# Altium project Quadrotor.PrjPCB (part 2 of 2)

## Sheet Battery Pack & Charger.SchDoc
size A4
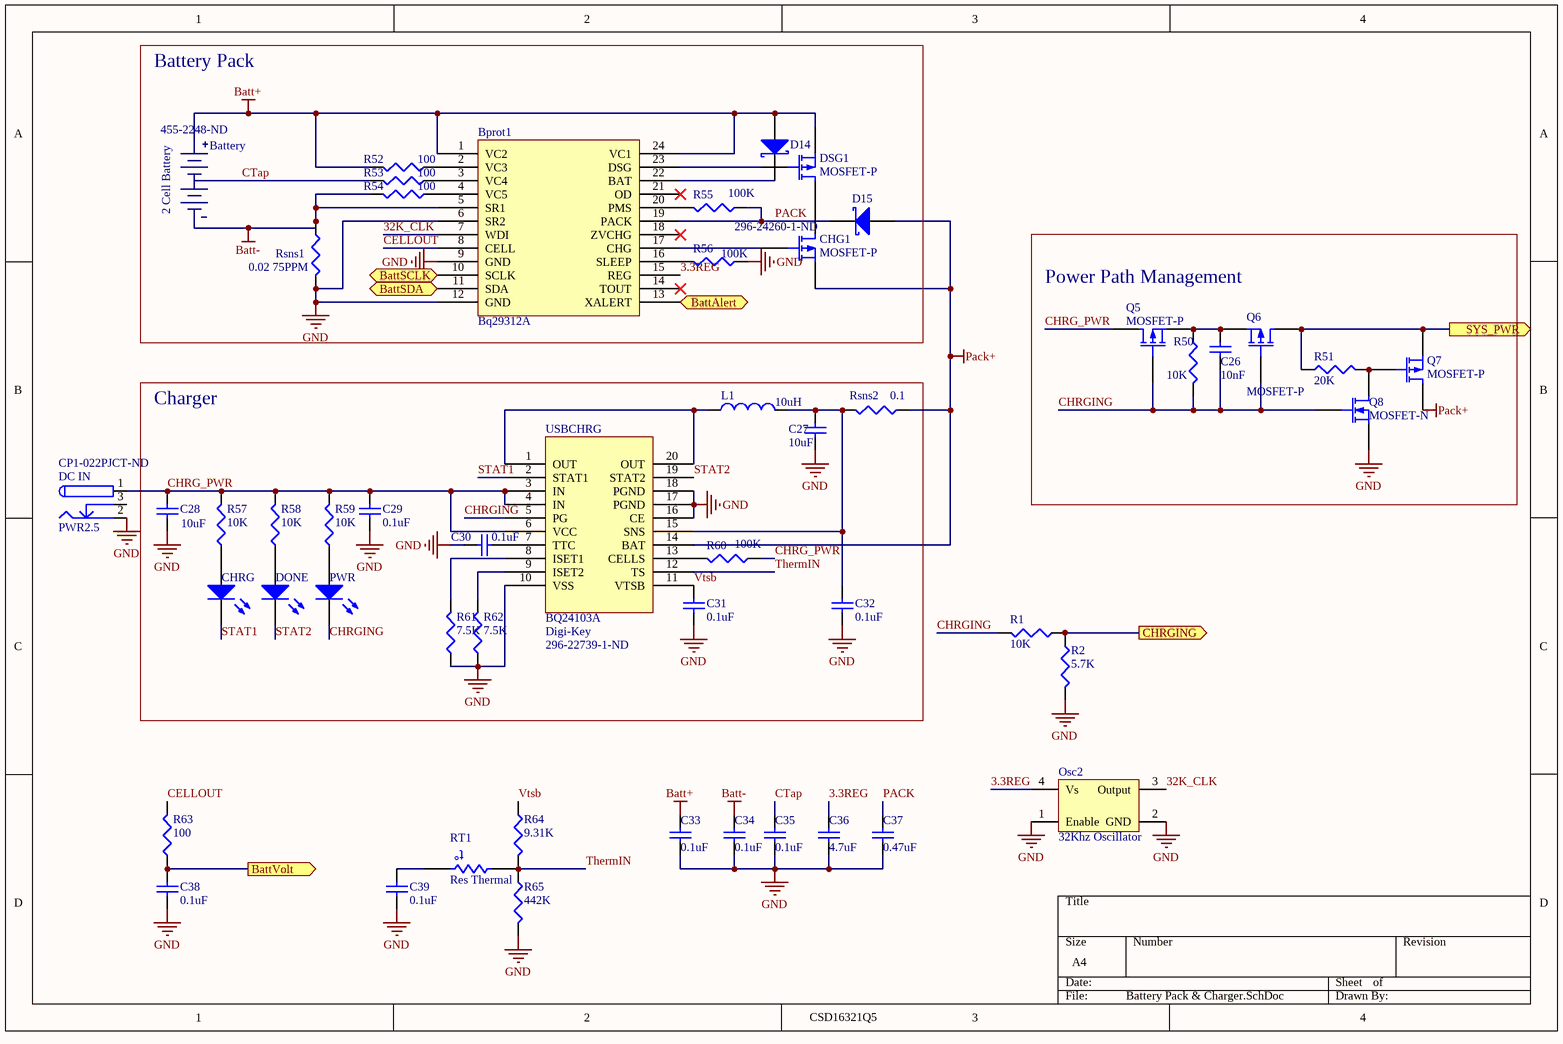
[diagram p7: Battery Pack & Charger.SchDoc]

### Parts
Battery  2 Cell Battery  Supplier Part Number 1: 455-2248-ND  [Turnigy Nanotech 2cell]
Bprot1  Bq29312A  [TSOP65P640X120-24N]
C26  value 10nF  [0603_CAP]  (hidden comment: X7R Cap)
C27  value 10uF  [0603_CAP]  (hidden comment: X7R Cap)
C28  value 10uF  [0603_CAP]  (hidden comment: X7R Cap)
C29  value 0.1uF  [0603_CAP]  (hidden comment: X7R Cap)
C30  value 0.1uF  [0603_CAP]  (hidden comment: X7R Cap)
C31  value 0.1uF  [0603_CAP]  (hidden comment: X7R Cap)
C32  value 0.1uF  [0603_CAP]  (hidden comment: X7R Cap)
C33  value 0.1uF  [0603_CAP]  (hidden comment: X7R Cap)
C34  value 0.1uF  [0603_CAP]  (hidden comment: X7R Cap)
C35  value 0.1uF  [0603_CAP]  (hidden comment: X7R Cap)
C36  value 4.7uF  [0603_CAP]  (hidden comment: X7R Cap)
C37  value 0.47uF  [0603_CAP]  (hidden comment: X7R Cap)
C38  value 0.1uF  [0603_CAP]  (hidden comment: X7R Cap)
C39  value 0.1uF  [0603_CAP]  (hidden comment: X7R Cap)
CHG1  MOSFET-P  [CSD16321Q5_PFET]
CHRG  LED0  [0603_RES]  (value not drawn)
D14  Diode 10TQ035  [DIODE]  (value not drawn)
D15  Diode 10TQ035  [DIODE]  (value not drawn)
DC_IN  PWR2.5  Supplier Part Number 1: CP1-022PJCT-ND  [DC Power JAck]
DONE  LED0  [0603_RES]  (value not drawn)
DSG1  MOSFET-P  [CSD16321Q5_PFET]
L1  value 10uH  [INDM7575X45N]  (hidden comment: Inductor)
Osc2  32Khz Oscillator  [Oscillator]
PWR  LED0  [0603_RES]  (value not drawn)
Q5  MOSFET-P  [CSD16321Q5_PFET]
Q6  MOSFET-P  [CSD16321Q5_PFET]
Q7  MOSFET-P  [CSD16321Q5_PFET]
Q8  MOSFET-N  [CSD16321Q5]
R1  value 10K  [0603_RES]  (hidden comment: Res3)
R2  value 5.7K  [0603_RES]  (hidden comment: Res3)
R50  value 10K  [0603_RES]  (hidden comment: Res3)
R51  value 20K  [0603_RES]  (hidden comment: Res3)
R52  value 100  [0603_RES]
R53  value 100  [0603_RES]
R54  value 100  [0603_RES]
R55  value 100K  [RESC1608L]
R56  value 100K  [RESC1608L]
R57  value 10K  [0603_RES]  (hidden comment: Res3)
R58  value 10K  [0603_RES]  (hidden comment: Res3)
R59  value 10K  [0603_RES]  (hidden comment: Res3)
R60  value 100K  [RESC1608L]
R61  value 7.5K  [0603_RES]
R62  value 7.5K  [0603_RES]
R63  value 100  [0603_RES]
R64  value 9.31K  [0603_RES]  (hidden comment: Rpull)
R65  value 442K  [0603_RES]  (hidden comment: Rpull)
Rsns1  value 0.02 75PPM  [CRA2512]
Rsns2  value 0.1  [CRA2512]  (hidden comment: Rpull)
RT1  Res Thermal  [RESC2012N]
USBCHRG  BQ24103A  Supplier 1: Digi-Key  [QFN50P350X450X100-20N]

### Blocks framed on the sheet
Battery Pack: Battery Bprot1 CHG1 D14 D15 DSG1 R52-R56 Rsns1
Power Path Management: C26 Q5-Q8 R50 R51
Charger: C27-C32 CHRG DONE L1 PWR R57-R62 Rsns2 USBCHRG

### Ports
BattAlert (out), BattSCLK (in), BattSDA (in), BattVolt (out), CHRGING (out), SYS_PWR (out)

### Nets
Batt+: Battery.1(+) Bprot1.1(VC2) Bprot1.24(VC1) C33.1 D14.1(A) DSG1.3(S) R52.2
Batt-: Battery.3(-) Bprot1.5(SR1) C34.1 R54.2 Rsns1.1
GND: Bprot1.6(SR2) Bprot1.9(GND) Bprot1.12(GND) C27.1 C28.1 C29.2 C30.1 C31.2 C32.2 C33.2 C34.2 C35.2 C36.2 C37.2 C38.1 C39.1 DC_IN.2 Osc2.1(Enable) Osc2.2(GND) Q8.3(S) R2.2 R56.1 R61.1 R62.1 R65.2 Rsns1.2 USBCHRG.10(VSS) USBCHRG.16(CE) USBCHRG.17(PGND) USBCHRG.18(PGND)
Pack+: CHG1.3(S) D15.2(A) Q7.1(D) Rsns2.1 USBCHRG.14(BAT)
PWR_IN: Q6.1(D) Q7.3(S) R51.1 ; port SYS_PWR
3.3REG: Bprot1.15(REG) C36.1 Osc2.4(Vs)
32K_CLK: Bprot1.7(WDI) Osc2.3(Output)
CELLOUT: Bprot1.8(CELL) R63.2
CHRG_PWR: C28.2 C29.1 DC_IN.1 Q5.1(D) R57.2 R58.2 R59.2 R60.1 USBCHRG.3(IN) USBCHRG.4(IN) USBCHRG.6(VCC)
CHRGING: C26.1 PWR.2(K) Q5.2(G) Q6.2(G) Q8.2(G) R1.2 R50.2 USBCHRG.5(PG)
CTap: Battery.2(Ctap) C35.1 R53.2
PACK: Bprot1.19(PACK) C37.1 D15.1(K) R55.1
STAT1: CHRG.2(K) USBCHRG.2(STAT1)
STAT2: DONE.2(K) USBCHRG.19(STAT2)
ThermIN: R64.2 R65.1 RT1.2 USBCHRG.12(TS)
Vtsb: C31.1 R64.1 USBCHRG.11(VTSB)
NetBprot1_2: Bprot1.2(VC3) R52.1
NetBprot1_3: Bprot1.3(VC4) R53.1
NetBprot1_4: Bprot1.4(VC5) R54.1
NetBprot1_10: Bprot1.10(SCLK) ; port BattSCLK
NetBprot1_11: Bprot1.11(SDA) ; port BattSDA
NetBprot1_13: Bprot1.13(XALERT) ; port BattAlert
NetBprot1_16: Bprot1.16(SLEEP) R56.2
NetBprot1_17: Bprot1.17(CHG) CHG1.2(G)
NetBprot1_20: Bprot1.20(PMS) R55.2
NetBprot1_22: Bprot1.22(BAT) D14.2(K)
NetBprot1_23: Bprot1.23(DSG) DSG1.2(G)
NetC26_2: C26.2 Q5.3(S) Q6.3(S) R50.1
NetC27_2: C27.2 C32.1 L1.2 Rsns2.2 USBCHRG.15(SNS)
NetC30_2: C30.2 USBCHRG.7(TTC)
NetC38_2: C38.2 R63.1 ; port BattVolt
NetC39_2: C39.2 RT1.1
NetCHG1_1: CHG1.1(D) DSG1.1(D)
NetCHRG_1: CHRG.1(A) R57.1
NetDONE_1: DONE.1(A) R58.1
NetL1_1: L1.1 USBCHRG.1(OUT) USBCHRG.20(OUT)
NetPWR_1: PWR.1(A) R59.1
NetQ7_2: Q7.2(G) Q8.1(D) R51.2
NetR1_1: R1.1 R2.1 ; port CHRGING
NetR60_2: R60.2 USBCHRG.13(CELLS)
NetR61_2: R61.2 USBCHRG.8(ISET1)
NetR62_2: R62.2 USBCHRG.9(ISET2)

Not connected (* = marked no-connect by the designer): Bprot1 14(TOUT)* 18(ZVCHG)* 21(OD)*; DC_IN 3

### Notes on the sheet
- CSD16321Q5
- (in symbol Res Thermal) t°

### Library data of the parts
Battery = 2 Cell Battery: Manufacturer: JST Sales America Inc; Manufacturer Part Number: B3B-XH-A  (LF)(SN)(P);; Description: CONN HEADER XH TOP 3POS 2.5MM; Connector Type: Header, Shrouded; Number of Positions: 3; Number of Positions Loaded: All; Pitch: 0.098" (2.50mm); Supplier 1: Digi-Key; RoHS: RoHS Compliant; Category: Connectors, Interconnects; Stock 1: 38279; Pricing 1: 1=0.12, 10=0.11, 100=0.0915, 500=0.07324, 1000=0.06079, 5000=0.05493, 10000=0.04871 (USD); Contact Type: Male Pin; Number of Rows: 1; Row Spacing: -; Contact Mating Length: -; Mounting Type: Through Hole; Termination: Press-Fit; Fastening Type: -; Features: -; Contact Finish: Tin; Contact Finish Thickness: -; Color: Natural; Packaging: Bulk; ComponentLink1URL: http://www.jst-mfg.com/product/pdf/eng/eXH.pdf; ComponentLink1Description: http://www.jst-mfg.com/product/pdf/eng/eXH.pdf
Bprot1 = Bq29312A: 296-19870-1-ND; Supplier 1: Digi-Key; Supplier Part Number 1: 296-19870-1-ND
C26-C39 = Cap: Capacitor; Published: 8-Jun-2000; LatestRevisionDate: 17-Jul-2002; LatestRevisionNote: Re-released for DXP Platform.; PackageReference: RAD-0.3; Publisher: Altium Limited
CHG1 DSG1 Q5-Q7 = MOSFET-P: 296-24260-1-ND; Manufacturer: Texas Instruments; Manufacturer Part Number: CSD25401Q3; Description: MOSFET P-CH 20V 60A 8-SON; FET Type: MOSFET P-Channel, Metal Oxide; FET Feature: Logic Level Gate; Rds On (Max) @ Id, Vgs: 11.7 mOhm @ 10A, 4.5V; Drain to Source Voltage (Vdss): 20V; Current - Continuous Drain (Id) @ 25° C: 60A; Vgs(th) (Max) @ Id: 1.2V @ 250µA; Gate Charge (Qg) @ Vgs: 12.3nC @ 4.5V; Input Capacitance (Ciss) @ Vds: 1400pF @ 10V; Power - Max: 2.8W; Published: 8-Jun-2000; LatestRevisionDate: 17-Jul-2002; LatestRevisionNote: Re-released for DXP Platform.; PackageVersion: 1995/1996; PackageReference: E3; Publisher: Altium Limited; Supplier 1: Digi-Key; Supplier Part Number 1: 296-24260-1-ND; RoHS: RoHS Compliant By Exemption; Category: Discrete Semiconductor Products; Stock 1: 15742; Pricing 1: 1=1.55, 25=1.2212, 100=1.0989, 250=0.95644, 500=0.8547, 1000=0.67155 (USD); Mounting Type: Surface Mount; Package / Case: 8-TDFN Exposed Pad; Supplier Device Package: 8-SON; Packaging: Cut Tape (CT); ComponentLink1URL: http://www.ti.com/lit/ds/symlink/csd25401q3.pdf; ComponentLink1Description: http://www.ti.com/lit/ds/symlink/csd25401q3.pdf
CHRG DONE PWR = LED0: Typical INFRARED GaAs LED; Published: 8-Jun-2000; LatestRevisionDate: 08-Jul-2005; LatestRevisionNote: Mech Layer 1 removed.; PackageReference: LED-0; Publisher: Altium Limited
D14 D15 = Diode 10TQ035: Schottky Rectifier; Manufacturer: ON Semiconductor; Manufacturer Part Number: MBRS320T3G; Note: Terminal 2 is the TAB and is electrically connected to the cathode; Description: DIODE SCHOTTKY 20V 4A SMC; Voltage - DC Reverse (Vr) (Max): 20V; Current - Average Rectified (Io): 4A; Voltage - Forward (Vf) (Max) @ If: 500mV @ 3A; Speed: Fast Recovery =< 500ns, > 200mA (Io); Current - Reverse Leakage @ Vr: 2mA @ 20V; Published: 8-Jun-2000; LatestRevisionDate: 17-Jul-2002; LatestRevisionNote: Re-released for DXP Platform.; DatasheetVersion: PD-2.057B; PackageVersion: Feb-1998; PackageReference: TO-220AC; Publisher: Altium Limited; ComponentLink1Description: Manufacturer Link; ComponentLink1URL: http://www.irf.com/; ComponentLink2Description: Datasheet; ComponentLink2URL: http://www.irf.com/product-info/datasheets/data/10tq.pdf; Supplier 1: Digi-Key; Supplier Part Number 1: MBRS320T3GOSCT-ND; RoHS: RoHS Compliant; Category: Discrete Semiconductor Products; Stock 1: 19790; Pricing 1: 1=0.8, 10=0.642, 100=0.4811, 250=0.41552, 500=0.35722, 1000=0.27702 (USD); Diode Type: Schottky; Reverse Recovery Time (trr): -; Capacitance @ Vr, F: -; Mounting Type: Surface Mount; Package / Case: DO-214AB, SMC; Supplier Device Package: SMCJ (DO-214AB); Packaging: Cut Tape (CT); ComponentLink3URL: http://www.onsemi.com/pub_link/Collateral/MBRS340T3-D.PDF; ComponentLink3Description: http://www.onsemi.com/pub_link/Collateral/MBRS340T3-D.PDF
DC_IN = PWR2.5: Low Voltage Power Supply Connector; Manufacturer: CUI Inc; Manufacturer Part Number: PJ1-022-SMT; Description: CONN PWR JACK DC 0.65X2.75MM SMD; Connector Type: Jack; Gender: Male; Plug/Mating Plug Diameter: 0.70mm ID, 2.35mm OD (EIAJ-1); Number of Positions/Contacts: 2 Conductors, 3 Contacts; Internal Switch(s): Single Switch, Normally Closed; Shielding: Unshielded; Voltage - Rated: 16VDC; Current Rating: 2.5A; Published: 17-Dec-2003; DatasheetDocument: 09-May-2002; Publisher: Altium Limited; ComponentLink1Description: Manufacturer Link; ComponentLink1URL: http://domino.kycon.com/internet/Products.html; Supplier 1: Digi-Key; RoHS: RoHS Compliant; Category: Connectors, Interconnects; Stock 1: 6275; Pricing 1: 1=1.34, 10=1.04, 100=0.7936, 500=0.6336 (USD); Mounting Type: Surface Mount, Right Angle; Termination: Solder; Features: -; Color: Black; Contact Material: Brass; Contact Material - Plating: Silver; Housing Color: Black; Housing Material: Thermoplastic; Operating Temperature: -; ComponentLink2URL: http://products.cui.com/GetSpecForDigiKey.aspx?MFGNum=PJ1-022-SMT; ComponentLink2Description: http://products.cui.com/GetSpecForDigiKey.aspx?MFGNum=PJ1-022-SMT
L1 = Inductor: 308-1502-1-ND; Manufacturer: SUMIDA AMERICA COMPONENTS INC; Manufacturer Part Number: CDRH74NP-100MC; Code_IEC: 1005; Description: POWER INDUCTOR 10UH 1.84A SMD; Inductance: 10µH; Current: 1.84A; Tolerance: ±20%; Shielding: Shielded; DC Resistance (DCR): 49 mOhm Max; Frequency - Test: 100kHz; Published: 8-Jun-2000; LatestRevisionDate: 29-May-2009; LatestRevisionNote: IPC-7351 Footprint Added.; PackageReference: 0402-A; Publisher: Altium Limited; PackageDescription: Chip Inductor; Code_JEITA: 0402; Supplier 1: Digi-Key; Supplier Part Number 1: 308-1502-1-ND; RoHS: RoHS Compliant; Category: Inductors, Coils, Chokes; Stock 1: 8641; Pricing 1: 1=1.42, 10=1.29, 50=1.16, 100=0.96, 250=0.8 (USD); Current - Saturation: -; Current - Temperature Rise: -; Type: -; Q @ Freq: -; Frequency - Self Resonant: -; Package / Case: 0.295" L x 0.295" W x 0.177" H (7.50mm x 7.50mm x 4.50mm); Mounting Type: Surface Mount; Packaging: Cut Tape (CT); Operating Temperature: -; Material - Core: -; Applications: Power Supplies; ComponentLink1URL: http://www.sumida.com/products/pdf/CDRH74.pdf; ComponentLink1Description: http://www.sumida.com/products/pdf/CDRH74.pdf
Osc2 = 32Khz_Oscillator: 535-9999-1-ND; Manufacturer: Abracon Corporation; Manufacturer Part Number: ASDK-32.768KHZ-LRT; Description: OSCILLATOR 32.768KHZ 3.3V SMD; Frequency: 32.768kHz; Function: Tri-State (Output Enable); Output: CMOS; Voltage - Supply: 3.3V; Frequency Stability: ±25ppm; Current - Supply (Max): 3.5mA; Supplier Part Number 1: 535-9999-1-ND; Supplier 1: Digi-Key; RoHS: RoHS Compliant; Category: Crystals and Oscillators; Stock 1: 2339; Pricing 1: 1=5.06, 10=4.388, 50=3.8476, 100=3.0375, 500=2.565 (USD); Type: XO (Standard); Operating Temperature: -40°C ~ 85°C; Mounting Type: Surface Mount; Size / Dimension: 0.098" L x 0.079" W (2.50mm x 2.00mm); Height: 0.037" (0.95mm); Package / Case: 4-SMD, No Lead (DFN, LCC); Packaging: Cut Tape (CT); Current - Supply (Disable) (Max): -; ComponentLink1URL: http://www.abracon.com/Oscillators/ASDK.pdf; ComponentLink1Description: http://www.abracon.com/Oscillators/ASDK.pdf
Q8 = MOSFET-N: 296-24517-1-ND; Manufacturer: Texas Instruments; Description: MOSFET N-CH 25V 100A 8-SON; FET Type: MOSFET N-Channel, Metal Oxide; FET Feature: Logic Level Gate; Rds On (Max) @ Id, Vgs: 2.4 mOhm @ 25A, 8V; Drain to Source Voltage (Vdss): 25V; Current - Continuous Drain (Id) @ 25° C: 100A; Vgs(th) (Max) @ Id: 1.4V @ 250µA; Gate Charge (Qg) @ Vgs: 19nC @ 4.5V; Input Capacitance (Ciss) @ Vds: 3100pF @ 12.5V; Power - Max: 3.1W; Published: 8-Jun-2000; LatestRevisionDate: 17-Jul-2002; LatestRevisionNote: Re-released for DXP Platform.; PackageVersion: 1995/1996; PackageReference: E3; Publisher: Altium Limited; Supplier 1: Digi-Key; Supplier Part Number 1: 296-24517-1-ND; Manufacturer Part Number: CSD16321Q5; RoHS: RoHS Compliant By Exemption; Category: Discrete Semiconductor Products; Stock 1: 8409; Pricing 1: 1=2.28, 25=1.7552, 100=1.5925, 250=1.43, 500=1.235, 1000=1.04 (USD); Mounting Type: Surface Mount; Package / Case: 8-TDFN Exposed Pad; Supplier Device Package: 8-SON; Packaging: Cut Tape (CT); ComponentLink1URL: http://www.ti.com/lit/ds/symlink/csd16321q5.pdf; ComponentLink1Description: http://www.ti.com/lit/ds/symlink/csd16321q5.pdf
R1 R2 R50-R62 = Res3: Resistor; Published: 8-Jun-2000; LatestRevisionDate: 29-May-2009; LatestRevisionNote: IPC-7351 Footprint Added.; PackageReference: J1-0603; Publisher: Altium Limited; PackageDescription: Chip Resistor
R63-R65 = Rpull: Resistor; Published: 8-Jun-2000; LatestRevisionDate: 29-May-2009; LatestRevisionNote: IPC-7351 Footprint Added.; PackageReference: J1-0603; Publisher: Altium Limited; PackageDescription: Chip Resistor
Rsns1 = Rpull: Resistor; Manufacturer: Bourns Inc.; Manufacturer Part Number: CRA2512-FZ-R020ELF; Description: RES .02 OHM 3W 1% 2512 SMD; Resistance (Ohms): 0.02; Power (Watts): 3W; Temperature Coefficient: ±75ppm/°C; Tolerance: ±1%; Published: 8-Jun-2000; LatestRevisionDate: 29-May-2009; LatestRevisionNote: IPC-7351 Footprint Added.; PackageReference: J1-0603; Publisher: Altium Limited; PackageDescription: Chip Resistor; Supplier 1: Digi-Key; Supplier Part Number 1: CRA2512-FZ-R020ELFCT-ND; RoHS: RoHS Compliant; Category: Resistors; Stock 1: 62600; Pricing 1: 1=0.49, 10=0.332, 50=0.299, 100=0.286, 250=0.26, 500=0.234, 1000=0.208 (USD); Composition: Metal Film; Features: Current Sense; Size / Dimension: 0.252" L x 0.126" W (6.40mm x 3.20mm); Height: 0.031" (0.80mm); Number of Terminations: 2; Packaging: Cut Tape (CT); Package / Case: 2512 (6432 Metric); ComponentLink1URL: http://www.bourns.com/data/global/PDFs/CRA.pdf; ComponentLink1Description: http://www.bourns.com/data/global/PDFs/CRA.pdf
Rsns2 = Rpull: Resistor; Manufacturer: Bourns Inc.; Manufacturer Part Number: CRA2512-FZ-R100ELF; Description: RES .10 OHM 3W 1% 2512 SMD; Power (Watts): 3W; Temperature Coefficient: ±75ppm/°C; Tolerance: ±1%; Published: 8-Jun-2000; LatestRevisionDate: 29-May-2009; LatestRevisionNote: IPC-7351 Footprint Added.; PackageReference: J1-0603; Publisher: Altium Limited; PackageDescription: Chip Resistor; Supplier 1: Digi-Key; Supplier Part Number 1: CRA2512-FZ-R100ELFCT-ND; RoHS: RoHS Compliant; Category: Resistors; Stock 1: 42912; Pricing 1: 1=0.49, 10=0.332, 50=0.299, 100=0.286, 250=0.26, 500=0.234, 1000=0.208 (USD); Resistance (Ohms): 0.1; Composition: Metal Film; Features: Current Sense; Size / Dimension: 0.252" L x 0.126" W (6.40mm x 3.20mm); Height: 0.031" (0.80mm); Number of Terminations: 2; Packaging: Cut Tape (CT); Package / Case: 2512 (6432 Metric); ComponentLink1URL: http://www.bourns.com/data/global/PDFs/CRA.pdf; ComponentLink1Description: http://www.bourns.com/data/global/PDFs/CRA.pdf
RT1 = Res Thermal: Thermistor; Published: 24-Mar-1999; LatestRevisionDate: 29-May-2009; LatestRevisionNote: IPC-7351 Footprint Added.; PackageVersion: Mar-2003; PackageReference: 6-0805; Publisher: Altium Limited; PackageDescription: Chip Resistor 0805 Case Size; Code_IPC: RESC2012
USBCHRG = Bq24103: 296-22739-1-ND; Supplier Part Number 1: 296-22739-1-ND

## Sheet Ext USB ver1.SchDoc
size A
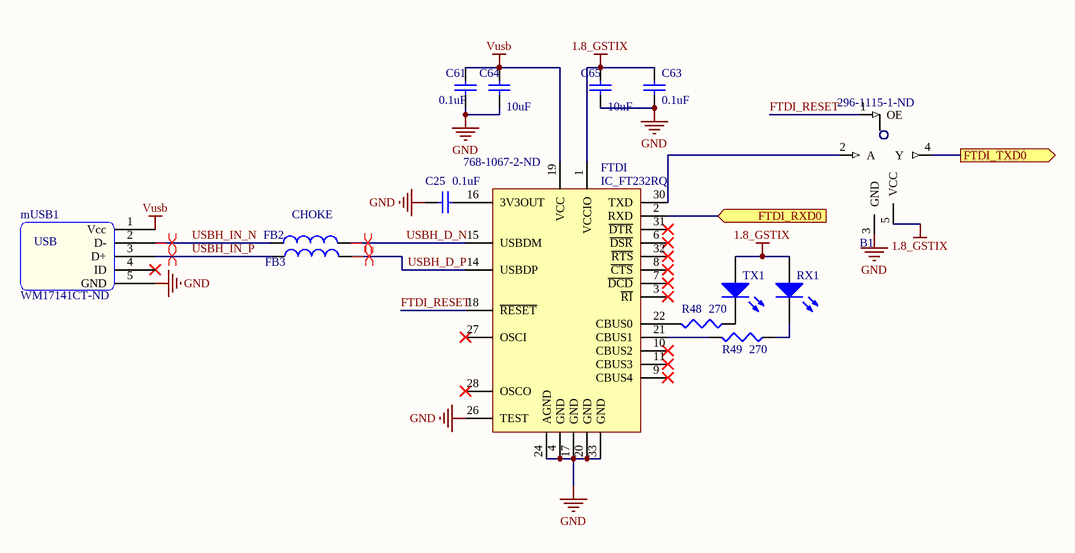
[diagram p8: Ext USB ver1.SchDoc]

### Parts
B1  Supplier Part Number 1: 296-1115-1-ND  [SOT95P280X145-5N]  (hidden comment: single tristate output line buffer)
C25  value 0.1uF  [0603_CAP]
C61  value 0.1uF  [0603_CAP]
C63  value 0.1uF  [0603_CAP]
C64  value 10uF  [0603_CAP]
C65  value 10uF  [0603_CAP]
FB2  CHOKE  [INDC1608L]  (value not drawn)
FB3  CHOKE  [INDC1608L]
FTDI  IC_FT232RQ  Supplier Part Number 1: 768-1067-2-ND  [QFN-32]
mUSB1  microUSB  [microUSB]  (value not drawn)
R48  value 270  [0603_Res]  (hidden comment: Rpull)
R49  value 270  [0603_Res]  (hidden comment: Rpull)
RX1  LED0  [0603_RES]  (value not drawn)
TX1  LED0  [0603_RES]  (value not drawn)

### Ports
FTDI_RXD0 (in), FTDI_TXD0 (out)

### Nets
1.8_GSTIX: B1.5(VCC) C63.2 C65.1 FTDI.1(VCCIO) RX1.1(A) TX1.1(A)
GND: B1.3(GND) C25.2 C61.2 C63.1 C64.2 C65.2 FTDI.4(GND) FTDI.17(GND) FTDI.20(GND) FTDI.24(AGND) FTDI.26(TEST) FTDI.33(GND) mUSB1.5(GND)
NC: FTDI.5(NC) FTDI.12(NC) FTDI.13(NC) FTDI.23(NC) FTDI.25(NC) FTDI.29(NC)
Vusb: C61.1 C64.1 FTDI.19(VCC) mUSB1.1(Vcc)
FTDI_RESET: B1.1(OE) FTDI.18(~{RESET})
USBH_D_N: FB2.2 FTDI.15(USBDM)
USBH_D_P: FB3.2 FTDI.14(USBDP)
USBH_IN_N: FB2.1 mUSB1.2(D-)
USBH_IN_P: FB3.1 mUSB1.3(D+)
NetB1_2: B1.2(A) FTDI.30(TXD)
NetB1_4: B1.4(Y) ; port FTDI_TXD0
NetC25_1: C25.1 FTDI.16(3V3OUT)
NetFTDI_2: FTDI.2(RXD) ; port FTDI_RXD0
NetFTDI_21: FTDI.21(CBUS1) R49.2
NetFTDI_22: FTDI.22(CBUS0) R48.2
NetR48_1: R48.1 TX1.2(K)
NetR49_1: R49.1 RX1.2(K)

Not connected (* = marked no-connect by the designer): FTDI 3(~{RI})* 6(~{DSR})* 7(~{DCD})* 8(~{CTS})* 9(CBUS4)* 10(CBUS2)* 11(CBUS3)* 27(OSCI)* 28(OSCO)* 31(~{DTR})* 32(~{RTS})*; mUSB1 4(ID)*

### Layout directives
differential pair: USBH_D_N, USBH_D_P, USBH_IN_N, USBH_IN_P

### Notes on the sheet
- (in symbol microUSB) USB

### Library data of the parts
B1 = 74AHC1G126DCK: 296-8747-1-ND; Manufacturer: Texas Instruments; Manufacturer Part Number: SN74AHCT1G32DBVR; Description: IC SGL 2IN POS-OR GATE SOT23-5; Logic Type: OR Gate; Number of Inputs: 2; Number of Circuits: 1; Current - Output High, Low: 8mA, 8mA; Voltage - Supply: 4.5 V ~ 5.5 V; Supplier 1: Digi-Key; RoHS: RoHS Compliant; Category: Integrated Circuits (ICs); Stock 1: 12354; Pricing 1: 1=0.42, 25=0.2372, 100=0.18, 250=0.12752, 500=0.102, 1000=0.078 (USD); Operating Temperature: -40°C ~ 85°C; Mounting Type: Surface Mount; Package / Case: SC-74A, SOT-753; Supplier Device Package: SOT-23-5; Packaging: Cut Tape (CT); ComponentLink1URL: http://www.ti.com/lit/ds/symlink/sn74ahct1g32.pdf; ComponentLink1Description: http://www.ti.com/lit/ds/symlink/sn74ahct1g32.pdf
C25 C61 C63-C65 = Cap: Capacitor; Published: 8-Jun-2000; LatestRevisionDate: 17-Jul-2002; LatestRevisionNote: Re-released for DXP Platform.; PackageReference: RAD-0.3; Publisher: Altium Limited
FB2 FB3 = Inductor: Manufacturer: Taiyo Yuden; Manufacturer Part Number: BK1608HS220-T; Code_IEC: 1005; Description: FERRITE BEAD 22 OHM 0603; Impedance @ Frequency: 22 Ohm @ 100MHz; Current Rating: 1.5A; DC Resistance (DCR): 50 mOhm Max; Filter Type: Differential Mode - Single; Number of Lines: 1; Published: 8-Jun-2000; LatestRevisionDate: 29-May-2009; LatestRevisionNote: IPC-7351 Footprint Added.; PackageReference: 0402-A; Publisher: Altium Limited; PackageDescription: Chip Inductor; Code_JEITA: 0402; Supplier 1: Digi-Key; Supplier Part Number 1: 587-1869-1-ND; RoHS: RoHS Compliant; Category: Filters; Stock 1: 27225; Pricing 1: 1=0.33, 10=0.22, 50=0.1142, 100=0.088, 250=0.06324, 500=0.0451, 1000=0.033 (USD); Package / Case: 0603 (1608 Metric); Mounting Type: Surface Mount; Packaging: Cut Tape (CT); Height (Max): 0.037" (0.95mm); Size / Dimension: 0.063" L x 0.031" W (1.60mm x 0.80mm); ComponentLink1URL: http://www.yuden.co.jp/us/product/pdf/mlci07_e.pdf; ComponentLink1Description: http://www.yuden.co.jp/us/product/pdf/mlci07_e.pdf
FTDI = IC_FT232RQ: FT232R USB UART; Manufacturer Part Number: FT232BQ-REEL; Description: IC NEW DESIGNS REFER TO FT232RQ; Number of Channels: 1, UART; FIFO's: 256 Byte; Protocol: RS-232, RS-422, RS-485; Voltage - Supply: 4.35 V ~ 5.25 V; With Auto Flow Control: Yes; Manufacturer: *; Note: *; ManufacturerPartNo: *; Supplier 1: Digi-Key; RoHS: RoHS Compliant; Category: Integrated Circuits (ICs); Stock 1: 2500; Pricing 1: 2500=3.00001, 5000=2.9375 (USD); Features: -; With Parallel Port: -; With IrDA Encoder/Decoder: -; With False Start Bit Detection: -; With Modem Control: Yes; With CMOS: Yes; Mounting Type: Surface Mount; Package / Case: 32-WFQFN Exposed Pad; Supplier Device Package: 32-QFN Exposed Pad (5x5); Packaging: Tape & Reel (TR); ComponentLink1URL: http://www.ftdichip.com/Support/Documents/DataSheets/ICs/DS_FT232BL_BQ.pdf; ComponentLink1Description: http://www.ftdichip.com/Support/Documents/DataSheets/ICs/DS_FT232BL_BQ.pdf
mUSB1 = microUSB: WM17141CT-ND; Manufacturer: Molex Inc; Manufacturer Part Number: 47346-0001; Description: CONN RCPT 5POS MICRO USB R/A; Connector Type: USB - micro B; Number of Contacts: 5; Gender: Receptacle; Impedance @ Frequency: 22 Ohm @ 100MHz; Current Rating: 1.5A; DC Resistance (DCR): 50 mOhm Max; Filter Type: Differential Mode - Single; Number of Lines: 1; Supplier 1: Digi-Key; RoHS: RoHS Compliant; Category: Connectors, Interconnects; Stock 1: 13846; Pricing 1: 1=1.31, 10=1.016, 50=0.8594, 100=0.775, 250=0.65312, 500=0.61876, 1000=0.55 (USD); Specifications: -; Mounting Type: Surface Mount, Right Angle, Horizontal; Features: Shielded; Packaging: Cut Tape (CT); Ingress Protection: -; ComponentLink1URL: http://www.molex.com/pdm_docs/sd/473460001_sd.pdf; ComponentLink1Description: http://www.molex.com/pdm_docs/sd/473460001_sd.pdf; Supplier Part Number 1: WM17141CT-ND; Supplier 2: Digi-Key; Supplier Part Number 2: 587-1869-1-ND; Stock 2: 27225; Pricing 2: 1=0.33, 10=0.22, 50=0.1142, 100=0.088, 250=0.06324, 500=0.0451, 1000=0.033 (USD); Package / Case: 0603 (1608 Metric); Height (Max): 0.037" (0.95mm); Size / Dimension: 0.063" L x 0.031" W (1.60mm x 0.80mm); ComponentLink2URL: http://www.yuden.co.jp/us/product/pdf/mlci07_e.pdf; ComponentLink2Description: http://www.yuden.co.jp/us/product/pdf/mlci07_e.pdf
R48 R49 = Rpull: Resistor; Published: 8-Jun-2000; LatestRevisionDate: 29-May-2009; LatestRevisionNote: IPC-7351 Footprint Added.; PackageReference: J1-0603; Publisher: Altium Limited; PackageDescription: Chip Resistor
RX1 TX1 = LED0: Typical INFRARED GaAs LED; Published: 8-Jun-2000; LatestRevisionDate: 08-Jul-2005; LatestRevisionNote: Mech Layer 1 removed.; PackageReference: LED-0; Publisher: Altium Limited

## Sheet Stage2Sensors.SchDoc
size A
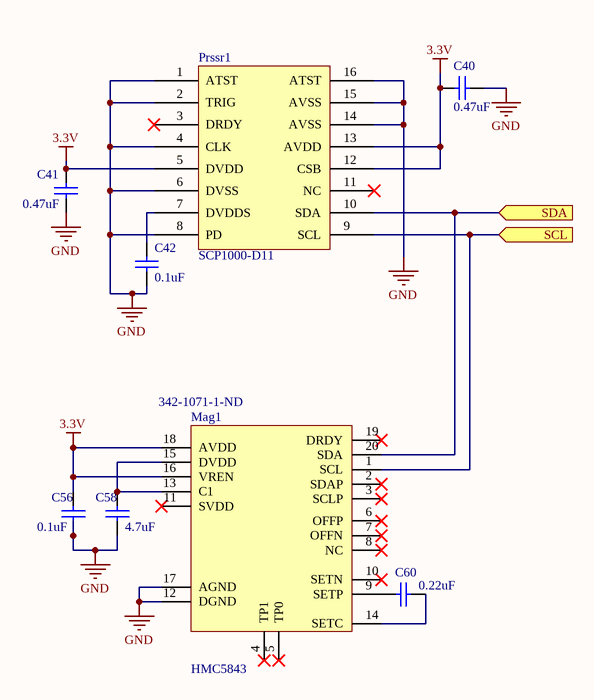
[diagram p9: Stage2Sensors.SchDoc]

### Parts
C40  value 0.47uF  [0603_CAP]  (hidden comment: X7R Cap)
C41  value 0.47uF  [0603_CAP]  (hidden comment: X7R Cap)
C42  value 0.1uF  [0603_CAP]  (hidden comment: X7R Cap)
C56  value 0.1uF  [0603_CAP]  (hidden comment: X7R Cap)
C58  value 4.7uF  [0603_CAP]  (hidden comment: X7R Cap)
C60  value 0.22uF  [0603_CAP]  (hidden comment: X7R Cap)
Mag1  HMC5843  Supplier Part Number 2: 342-1071-1-ND  [HMC5843]
Prssr1  SCP1000-D11  [SCP1000-D11]

### Ports
SCL (in), SDA (in)

### Nets
3.3V: C40.2 C41.2 C56.2 Mag1.16(VREN) Mag1.18(AVDD) Prssr1.5(DVDD) Prssr1.12(CSB) Prssr1.13(AVDD)
GND: C40.1 C41.1 C42.2 C56.1 C58.1 Mag1.12(DGND) Mag1.17(AGND) Prssr1.1(ATST) Prssr1.2(TRIG) Prssr1.4(CLK) Prssr1.6(DVSS) Prssr1.8(PD) Prssr1.14(AVSS) Prssr1.15(AVSS) Prssr1.16(ATST)
NetBprot1_10: Mag1.1(SCL) Prssr1.9(SCL) ; port SCL
NetBprot1_11: Mag1.20(SDA) Prssr1.10(SDA) ; port SDA
NetC42_1: C42.1 Prssr1.7(DVDDS)
NetC58_2: C58.2 Mag1.13(C1) Mag1.15(DVDD)
NetC60_1: C60.1 Mag1.14(SETC)
NetC60_2: C60.2 Mag1.9(SETP)

Not connected (* = marked no-connect by the designer): Mag1 2(SDAP)* 3(SCLP)* 4(TP1)* 5(TP0)* 6(OFFP)* 7(OFFN)* 8(NC)* 10(SETN)* 11(SVDD)* 19(DRDY)*; Prssr1 3(DRDY)* 11(NC)*

### Library data of the parts
C40-C42 C56 C58 C60 = Cap: Capacitor; Published: 8-Jun-2000; LatestRevisionDate: 17-Jul-2002; LatestRevisionNote: Re-released for DXP Platform.; PackageReference: RAD-0.3; Publisher: Altium Limited
Mag1 = Magnetometer HMC5843: Manufacturer: Honeywell Microelectronics & Precision Sensors; Manufacturer Part Number: HMC5843-TR; Description: SENSOR MAGNETIC 3 AXIS 20-LCC; Sensing Range: ±4g; Voltage - Supply: 2.5 V ~ 3.3 V; Current - Supply: 80µA; Output Type: Differential Voltage; Supplier 1: Sparkfun; Supplier Part Number 1: COM-09441; Supplier 2: Digi-Key; RoHS: RoHS Compliant; Category: Sensors, Transducers; Stock 2: 0; Type: Compass - Three Axis; Current - Output (Max): -; Features: Compass - Three Axis; Operating Temperature: -30°C ~ 80°C; Package / Case: 20-LCC; Supplier Device Package: 20-LCC; Packaging: Cut Tape (CT); ComponentLink1URL: http://www51.honeywell.com/aero/common/documents/myaerospacecatalog-documents/Defense_Brochures-documents/HMC5843.pdf; ComponentLink1Description: http://www51.honeywell.com/aero/common/documents/myaerospacecatalog-documents/Defense_Brochures-documents/HMC5843.pdf

## Nets that join several sheets
1.8_GSTIX: Microcontroller (Vtrans1.1 Vtrans1.5), Gumstix (C7.1 Reg1.5), Ext USB ver1 (6 pins)
3.3V: E1 (C55_E1.1 uC1_E1.4 uC1_E1.6 uC1_E1.18), E2 (C55_E2.1 uC1_E2.4 uC1_E2.6 uC1_E2.18), E3 (C55_E3.1 uC1_E3.4 uC1_E3.6 uC1_E3.18), E4 (C55_E4.1 uC1_E4.4 uC1_E4.6 uC1_E4.18), System Power Supply (5 pins), Inertial Sensors (10 pins), Obstacle Sensors (14 pins), Microcontroller (9 pins), Gumstix (11 pins), Stage2Sensors (8 pins)
Batt+: E1 (8 pins), E2 (8 pins), E3 (8 pins), E4 (8 pins), Battery Pack & Charger (7 pins)
GND: E1 (21 pins), E2 (21 pins), E3 (21 pins), E4 (21 pins), System Power Supply (10 pins), Inertial Sensors (15 pins), Obstacle Sensors (25 pins), Microcontroller (12 pins), Gumstix (13 pins), Battery Pack & Charger (30 pins), Ext USB ver1 (13 pins), Stage2Sensors (15 pins)
PWR_IN: System Power Supply (3.3PWR.1 3.3PWR.2 C51.2 C66.1), Battery Pack & Charger (Q6.1 Q7.3 R51.1)
MCU_ADC0: Obstacle Sensors (C18.2 R35.1), Microcontroller (U1.19)
MCU_ADC1: Obstacle Sensors (C19.2 R36.1), Microcontroller (U1.24)
MCU_ADC2: Obstacle Sensors (C20.2 R37.1), Microcontroller (U1.25)
MCU_ADC3: Obstacle Sensors (C21.2 R38.1), Microcontroller (U1.26)
MCU_ADC4: Obstacle Sensors (C22.2 R39.1), Microcontroller (U1.23)
MCU_ADC5: Obstacle Sensors (C23.2 R40.1), Microcontroller (U1.22)
NetACCEL_8: Inertial Sensors (ACCEL.8), Microcontroller (U1.1)
NetACCEL_9: Inertial Sensors (ACCEL.9), Microcontroller (U1.11)
NetB1_4: Main (JP1.2), Ext USB ver1 (B1.4)
NetBprot1_10: Inertial Sensors (IMU.23), Microcontroller (R66.1 U1.28), Battery Pack & Charger (Bprot1.10), Stage2Sensors (Mag1.1 Prssr1.9)
NetBprot1_11: Inertial Sensors (IMU.24), Microcontroller (R47.1 U1.27), Battery Pack & Charger (Bprot1.11), Stage2Sensors (Mag1.20 Prssr1.10)
NetC38_2: Gumstix (R71.1), Battery Pack & Charger (C38.2 R63.1)
NetFTDI_2: Main (JP2.2), Ext USB ver1 (FTDI.2)
NetGSTX1_26: Main (JP2.3), Gumstix (GSTX1.26)
NetGSTX1_31: Main (JP1.3), Gumstix (GSTX1.31)
NetIMU_12: Inertial Sensors (IMU.12), Microcontroller (U1.32)
NetJP1_1: Main (JP1.1), Microcontroller (Vtrans1.2), Gumstix (JP4.2)
NetJP2_1: Main (JP2.1), Microcontroller (Vtrans1.6), Gumstix (JP3.2)
NetR1_1: E1 (R7_E1.2), E2 (R7_E2.2), E3 (R7_E3.2), E4 (R7_E4.2), Battery Pack & Charger (R1.1 R2.1)
PULSE: Obstacle Sensors (R27.1), Microcontroller (U1.2)
PWM1: E1 (R8_E1.2), Microcontroller (U1.14)
PWM2: E2 (R8_E2.2), Microcontroller (U1.13)
PWM3: E3 (R8_E3.2), Microcontroller (U1.9)
PWM4: E4 (R8_E4.2), Microcontroller (U1.10)